# Altium schematic sheet MCU+GPIO.SchDoc
size 420 x 297 mm; SheetNumber: 9; SheetTotal: 9
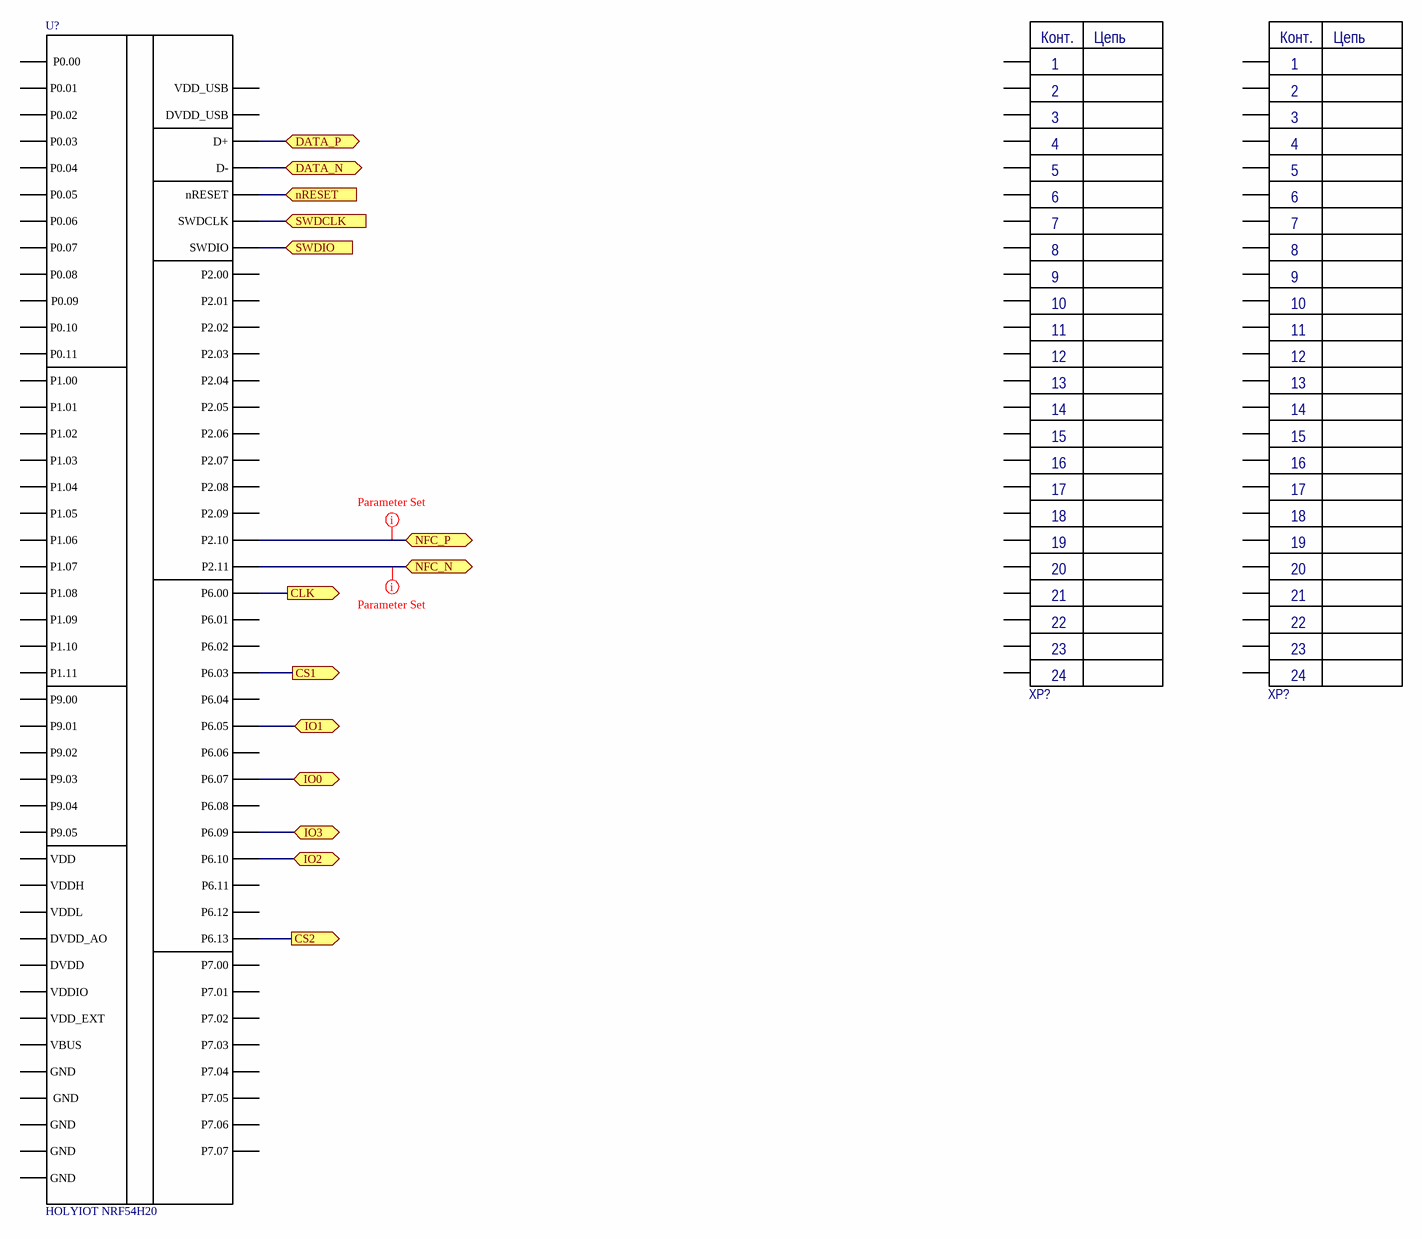
[diagram p0: MCU+GPIO.SchDoc]

## Parts
(Parts that share a designator on the sheet are numbered #1, #2 ... from top to bottom, then left to right.)
U?  HOLYIOT NRF54H20  [HOLYIOT NRF54H20]
XP?#1  PLD-24  [PLD-24]  (value not drawn)
XP?#2  PLD-24  [PLD-24]  (value not drawn)

## Ports
CLK (out), CS1 (out), CS2 (out), DATA_N (bidir), DATA_P (bidir), IO0 (bidir), IO1 (bidir), IO2 (bidir), IO3 (bidir), NFC_N (bidir), NFC_P (bidir), nRESET (in), SWDCLK (in), SWDIO (in)

## Nets
CLK: U?.15(P6.00) ; port CLK
CS1: U?.18(P6.03) ; port CS1
CS2: U?.7(P6.13) ; port CS2
DATA_N: U?.78(D-) ; port DATA_N
DATA_P: U?.79(D+) ; port DATA_P
IO0: U?.13(P6.07) ; port IO0
IO1: U?.20(P6.05) ; port IO1
IO2: U?.10(P6.10) ; port IO2
IO3: U?.11(P6.09) ; port IO3
NFC_N: U?.26(P2.11) ; port NFC_N
NFC_P: U?.27(P2.10) ; port NFC_P
nRESET: U?.72(nRESET) ; port nRESET
SWDCLK: U?.74(SWDCLK) ; port SWDCLK
SWDIO: U?.73(SWDIO) ; port SWDIO

Not connected (* = marked no-connect by the designer): U? 1(GND) 2(VDDH) 3(VDD) 4(_GND) 5(DVDD) 6(DVDD_AO) 8(P6.12) 9(P6.11) 12(P6.08) 14(P6.06) 16(P6.01) 17(P6.02) 19(P6.04) 21(P2.00) 22(P2.01) 23(P2.02) 24(P2.03) 25(P2.04) 28(GND) 29(GND) 30(P2.09) 31(P2.08) 32(P2.07) 33(P2.06) 34(P2.05) 35(P7.07) 36(P7.06) 37(P7.05) 38(P7.04) 39(P7.03) 40(P7.02) 41(P7.01) 42(P7.00) 43(_P0.09) 44(P0.08) 45(P0.05) 46(P0.06) 47(P0.07) 48(P9.00) 49(P9.01) 50(_P0.00) 51(P0.04) 52(P1.04) 53(P1.03) 54(P1.02) 55(VDDL) 56(P1.01) 57(P1.00) 58(GND) 59(P1.06) 60(P1.07) 61(P1.09) 62(P9.05) 63(P9.04) 64(P9.03) 65(P9.02) 66(P0.03) 67(P0.02) 68(P0.01) 69(P0.10) 70(P0.11) 71(VDDIO) 75(VDD_EXT) 76(DVDD_USB) 77(VBUS) 80(VDD_USB) 81(P1.10) 82(P1.11) 83(P1.08) 84(P1.05); XP?#1 1 2 3 4 5 6 7 8 9 10 11 12 13 14 15 16 17 18 19 20 21 22 23 24; XP?#2 1 2 3 4 5 6 7 8 9 10 11 12 13 14 15 16 17 18 19 20 21 22 23 24

## Layout directives
Импеданс: 50 Ом: NFC_N, NFC_P

## Notes on the sheet
- Перв. примен.
- Справ. №
- Подп. и дата
- Инв. № дубл.
- Взам. инв. №
- Изм.
- Лист
- № докум.
- Подп.
- Дата
- Лит.
- Масса
- Масштаб
- Т.контр.
- Пров.
- Разраб.
- Листов
- Инв. № подл.
- Н.контр.
- Утв.
- Копировал
- Формат А3
- (in symbol PLD-24) Конт.; Цепь

## Library data of the parts
XP?#1 XP?#2 = PLD-24: PLD connector; Manufacturer: NONAME; Connector type: Вилка на плату; Number of contacts: 24; Type: Разъем штыревой